# Altium schematic sheet MR_Power.SchDoc
size A4; CompanyName: BeeIonic; SheetNumber: 5; SheetTotal: 7
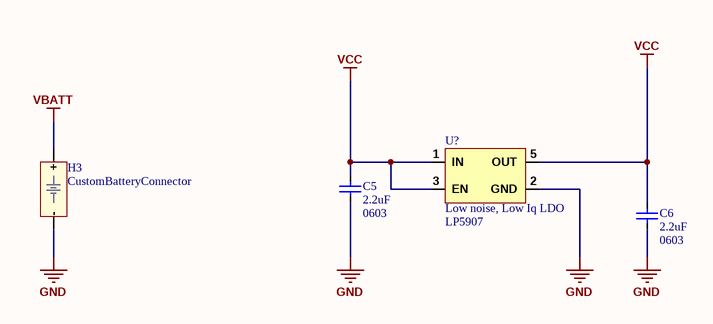
[diagram p0: MR_Power.SchDoc]

## Parts
C5  value 2.2uF  Package: 0603  [0603_CAP_LD]  (hidden comment: CerCap)
C6  value 2.2uF  Package: 0603  [0603_CAP_LD]  (hidden comment: CerCap)
H3  CustomBatteryConnector  [CustomBatteryConnector]
U?  Low noise, Low Iq LDO  [LP5907]

## Nets
GND: C5.1 C6.1 H3.- U?.2(GND)
VBATT: H3.+
VCC: C5.2 C6.2 U?.1(IN) U?.3(EN) U?.5(OUT)

Not connected (* = marked no-connect by the designer): U? 4(NC)

## Notes on the sheet
- Project :
- Title :
- Sheet:
- of
- Creation Date :
- Designer :
- Modified Date :

## Library data of the parts
C5 C6 = CerCap: Ceramic Capacitor; Type: *; Voltage/Power: *
H3 = BatteryConnector: Custom Battery Connector
U? = LP5907: LP5907 Low Noise Low Iq LDO; Reference: LP5907